# EAGLE design pressure (EAGLE 7.4.0)
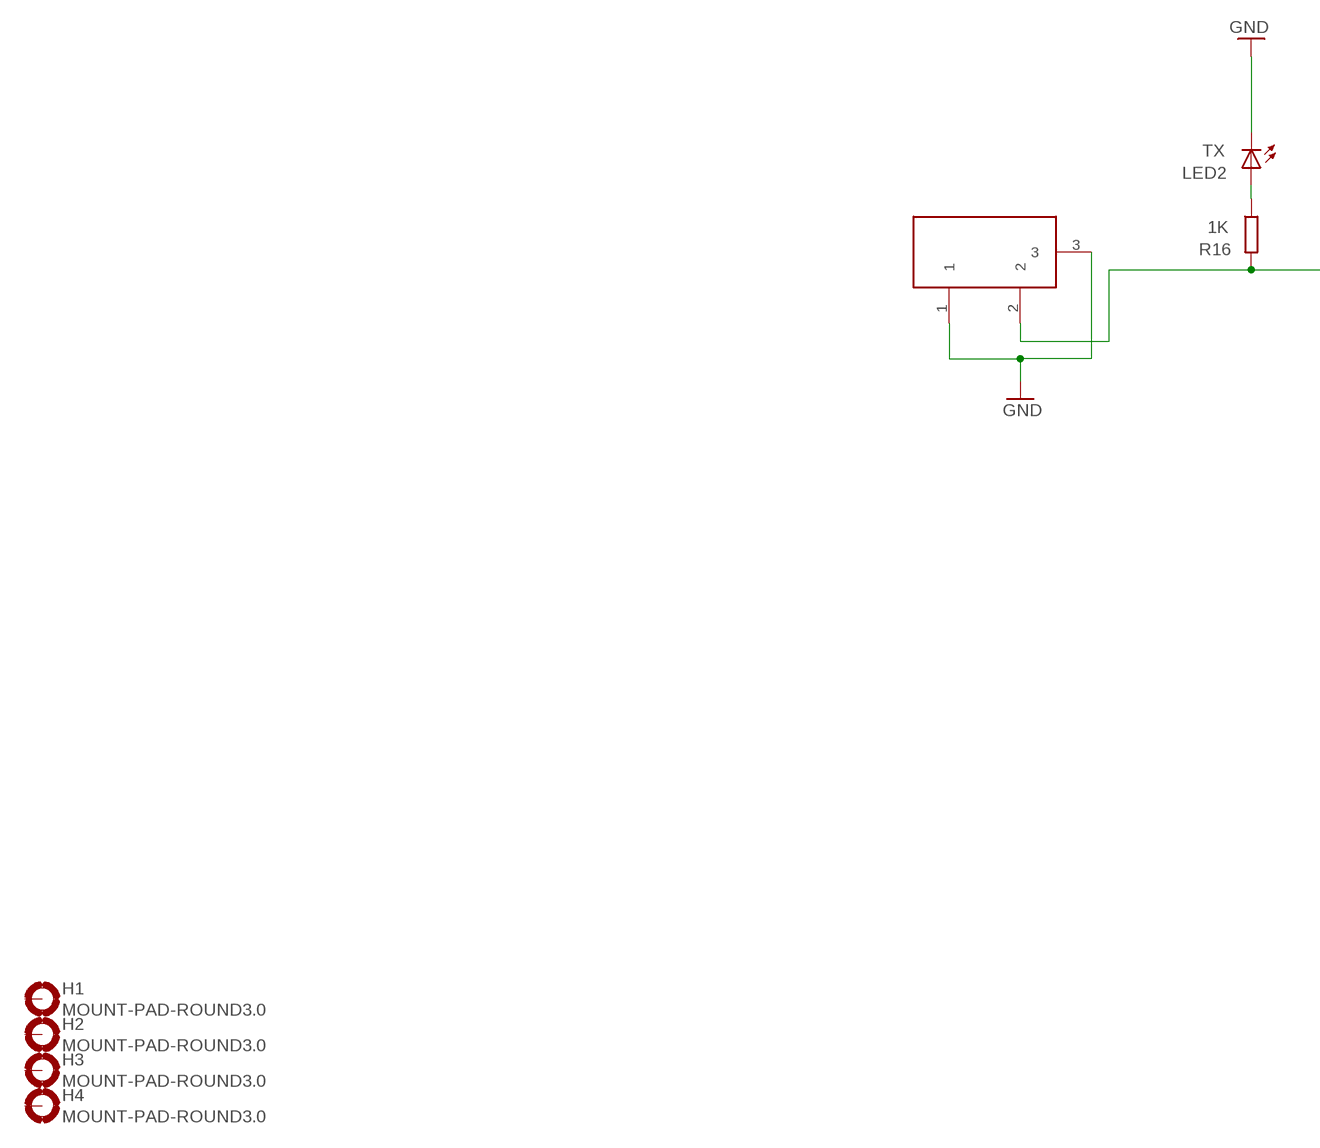
[diagram p0: schematic, sheet 1, part 1 of 2]
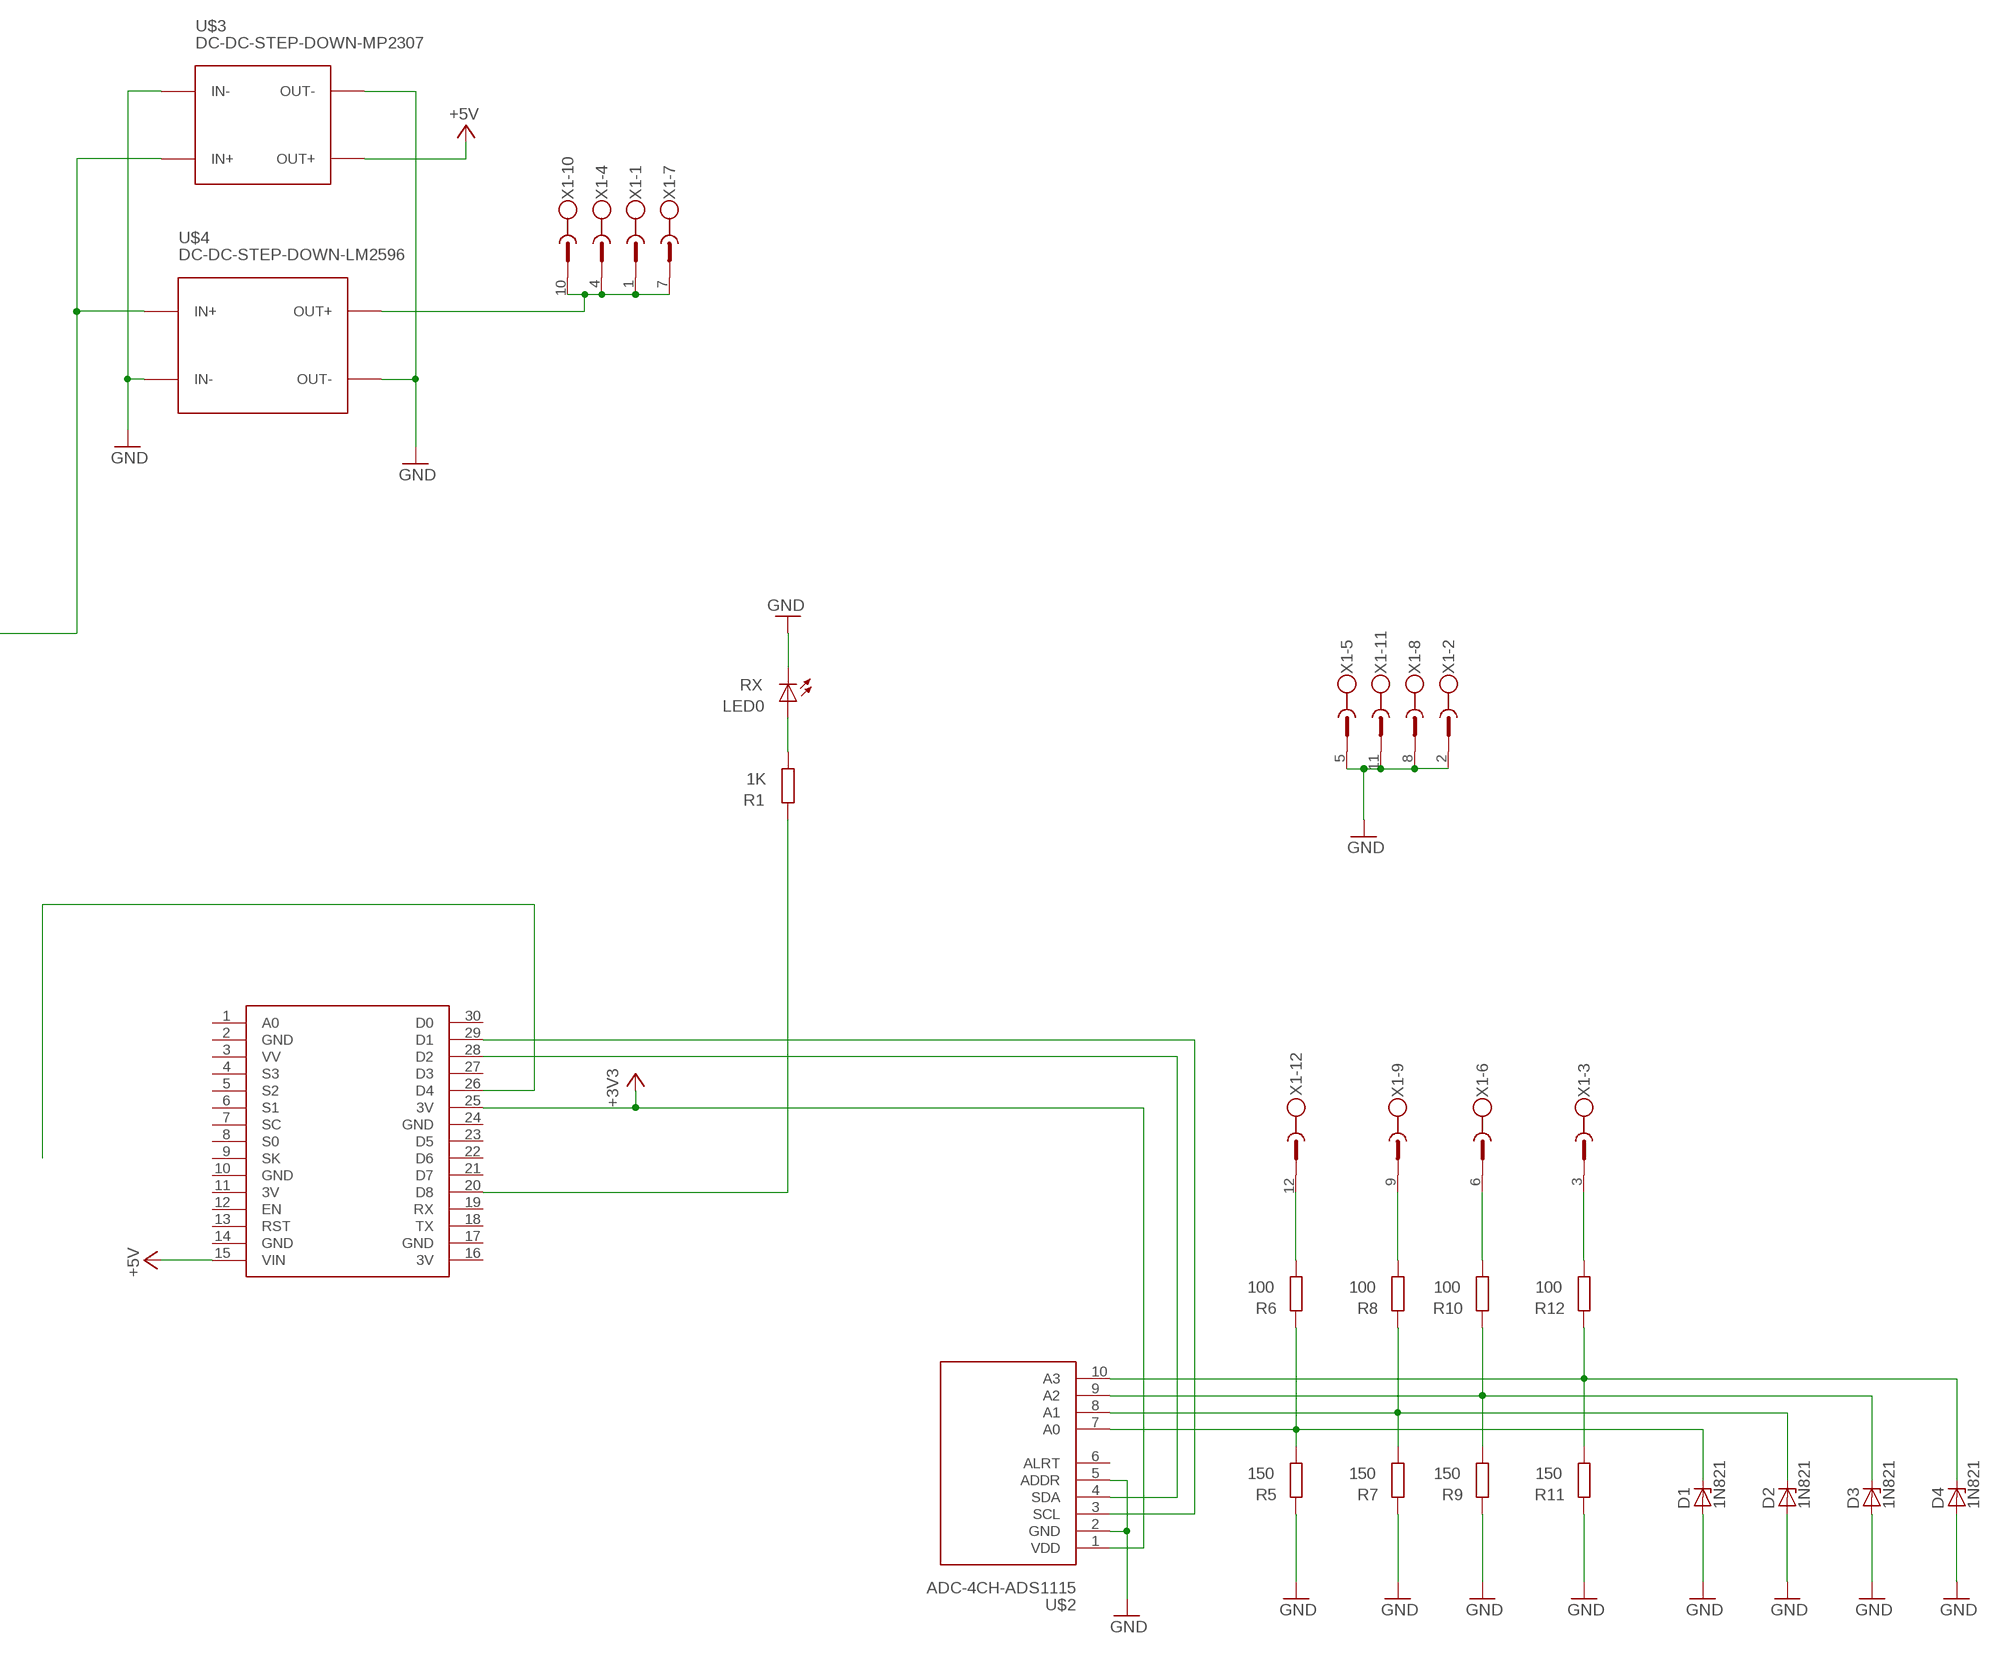
[diagram p1: schematic, sheet 1, part 2 of 2]

## Parts
D1  1N821  [DO35Z10]
D2  1N821  [DO35Z10]
D3  1N821  [DO35Z10]
D4  1N821  [DO35Z10]
DC1  DC21MMX  [DC-21MM]
H1  MOUNT-PAD-ROUND3.0  [3,0-PAD]
H2  MOUNT-PAD-ROUND3.0  [3,0-PAD]
H3  MOUNT-PAD-ROUND3.0  [3,0-PAD]
H4  MOUNT-PAD-ROUND3.0  [3,0-PAD]
LED0  RX  LED5MM  [LED5MM]
LED2  TX  LED5MM  [LED5MM]
R1  1K  R-EU_0207/10  [0207/10]
R5  150  R-EU_0207/10  [0207/10]
R6  100  R-EU_0207/10  [0207/10]
R7  150  R-EU_0207/10  [0207/10]
R8  100  R-EU_0207/10  [0207/10]
R9  150  R-EU_0207/10  [0207/10]
R10  100  R-EU_0207/10  [0207/10]
R11  150  R-EU_0207/10  [0207/10]
R12  100  R-EU_0207/10  [0207/10]
R16  1K  R-EU_0207/10  [0207/10]
U$1  NODEMCU  [NODEMCU]
U$2  ADC-4CH-ADS1115  [ADC-4CH-ADS1115]
U$3  DC-DC-STEP-DOWN-MP2307  [DC-DC-STEP-DOWN-MP2307]
U$4  DC-DC-STEP-DOWN-LM2596  [DC-DC-STEP-DOWN-LM2596]
X1  MSTBV12  [MSTBV12]

## Nets
+3V3: U$1.25(3V) U$2.1(VDD)
+5V [power]: U$1.15(VIN) U$3.OUT+
GND: D1.A D2.A D3.A D4.A DC1.1 DC1.3 LED0.K(C) LED2.K(C) R5.2 R7.2 R9.2 R11.2 U$2.2(GND) U$2.5(ADDR) U$3.IN- U$3.OUT- U$4.IN- U$4.OUT- X1.2 X1.5 X1.8 X1.11
N$2 [power]: DC1.2 R16.2 U$3.IN+ U$4.IN+
N$3: U$4.OUT+ X1.1 X1.4 X1.7 X1.10
N$5: D1.C R5.1 R6.2 U$2.7(A0)
N$6: D2.C R7.1 R8.2 U$2.8(A1)
N$7: D3.C R9.1 R10.2 U$2.9(A2)
N$10: R1.2 U$1.20(D8)
N$14: U$1.26(D4)
N$15: D4.C R11.1 R12.2 U$2.10(A3)
N$16: R6.1 X1.12
N$17: R8.1 X1.9
N$18: R10.1 X1.6
N$19: LED2.A R16.1
N$20: R12.1 X1.3
N$22: U$1.29(D1) U$2.3(SCL)
N$23: U$1.28(D2) U$2.4(SDA)
N$33: LED0.A R1.1
Unconnected: H1.B3,0(MOUNT) H2.B3,0(MOUNT) H3.B3,0(MOUNT) H4.B3,0(MOUNT) U$1.1(A0) U$1.3(VV) U$1.4(S3) U$1.5(S2) U$1.6(S1) U$1.7(SC) U$1.8(S0) U$1.9(SK) U$1.12(EN) U$1.13(RST) U$1.18(TX) U$1.19(RX) U$1.21(D7) U$1.22(D6) U$1.23(D5) U$1.27(D3) U$1.30(D0) U$2.6(ALRT)

## Power pins joined to a net without a drawn wire
3V: U$1.11(3V) U$1.16(3V)
GND: U$1.2(GND) U$1.10(GND) U$1.14(GND) U$1.17(GND) U$1.24(GND)

## Library data of the parts
D1-D4 = diode:1N821: Reference DIODE temperature compensated, 6,2 V
DC1 = powersupply:DC21MM
H1-H4 = holes:MOUNT-PAD-ROUND: MOUNTING PAD, round
LED0 LED2 = led:LED: LED OSRAM: - CHIPLED LG R971, LG N971, LY N971, LG Q971, LY Q971, LO R971, LY R971 LH N974, LH R974 LS Q976, LO Q976, LY Q976 LO Q996 - Hyper CHIPLED LW Q18S LB Q993, LB Q99A, LB R99A - SideLED LS A670, LO A670, LY A670, LG A670, LP A670 LB A673, LV A673, LT A673, LW A673 LH A674 LY A675 LS A676, LA A676, LO A676, LY A676, LW A676 LS A679, LY A679, LG A679 - Hyper Micro SIDELED® LS Y876, LA Y876, LO Y876, LY Y876 LT Y87S - SmartLED LW L88C, LW L88S LB L89C, LB L89S, LG L890 LS L89K, LO L89K, LY L89K LS L896, LA L896, LO L896, LY L896 - TOPLED LS T670, LO T670, LY T670, LG T670, LP T670 LSG T670, LSP T670, LSY T670, LOP T670, LYG T670 LG T671, LOG T671, LSG T671 LB T673, LV T673, LT T673, LW T673 LH T674 LS T676, LA T676, LO T676, LY T676, LB T676, LH T676, LSB T676, LW T676 LB T67C, LV T67C, LT T67C, LS T67K, LO T67K, LY T67K, LW E67C LS E67B, LA E67B, LO E67B, LY E67B, LB E67C, LV E67C, LT E67C LW T67C LS T679, LY T679, LG T679 LS T770, LO T770, LY T770, LG T770, LP T770 LB T773, LV T773, LT T773, LW T773 LH T774 LS E675, LA E675, LY E675, LS T675 LS T776, LA T776, LO T776, LY T776, LB T776 LHGB T686 LT T68C, LB T68C - Hyper Mini TOPLED® LB M676 - Mini TOPLED Santana® LG M470 LS M47K, LO M47K, LY M47K Source: http://www.osram.convergy.de LUXEON: - LUMILED® LXK2-PW12-R00, LXK2-PW12-S00, LXK2-PW14-U00, LXK2-PW14-V00 LXK2-PM12-R00, LXK2-PM12-S00, LXK2-PM14-U00 LXK2-PE12-Q00, LXK2-PE12-R00, LXK2-PE12-S00, LXK2-PE14-T00, LXK2-PE14-U00 LXK2-PB12-K00, LXK2-PB12-L00, LXK2-PB12-M00, LXK2-PB14-N00, LXK2-PB14-P00, LXK2-PB14-Q00 LXK2-PR12-L00, LXK2-PR12-M00, LXK2-PR14-Q00, LXK2-PR14-R00 LXK2-PD12-Q00, LXK2-PD12-R00, LXK2-PD12-S00 LXK2-PH12-R00, LXK2-PH12-S00 LXK2-PL12-P00, LXK2-PL12-Q00, LXK2-PL12-R00 Source: www.luxeon.com KINGBRIGHT: KA-3528ASYC Source: www.kingbright.com
R1 R5-R12 R16 = rcl:R-EU_: RESISTOR, European symbol
U$1 = nodemcu:NODEMCU
U$2 = diy-modules:ADC-4CH-ADS1115: 4 Channel 16-Bit Analog-to-Digital Converter based on ADS1115 chip Arduino ADS1115 Getting Started Tutorial is available here: http://henrysbench.capnfatz.com/henrys-bench/arduino-voltage-measurements/arduino-ads1115-module-getting-started-tutorial/ ADS1115 datasheet is available here: http://www.ti.com/lit/ds/symlink/ads1115.pdf Click here to find device on ebay.com <http://www.ebay.com/sch/ads1115+module>
U$3 = diy-modules:DC-DC-STEP-DOWN-MP2307: DC/DC Step-Down Regulator based on MP2307DN chip MP2307 datasheet available here: https://cdn-shop.adafruit.com/datasheets/MP2307_r1.9.pdf Click here to find device on ebay.com <http://www.ebay.com/sch/dc+dc+3a+mini+converter>
U$4 = diy-modules:DC-DC-STEP-DOWN-LM2596: DC/DC Step-Down Regulator based on LM2596-ADJ chip LM2596 datasheet available here: http://www.ti.com/lit/ds/symlink/lm2596.pdf Click here to find device on ebay.com <http://www.ebay.com/sch/lm2596+power+regulator>
X1 = con-phoenix-custom:MSTBV12: PHOENIX; OC_FARNELL: unknown; OC_NEWARK: unknown

## Net classes
1 power: width 0.61 mm

## Board
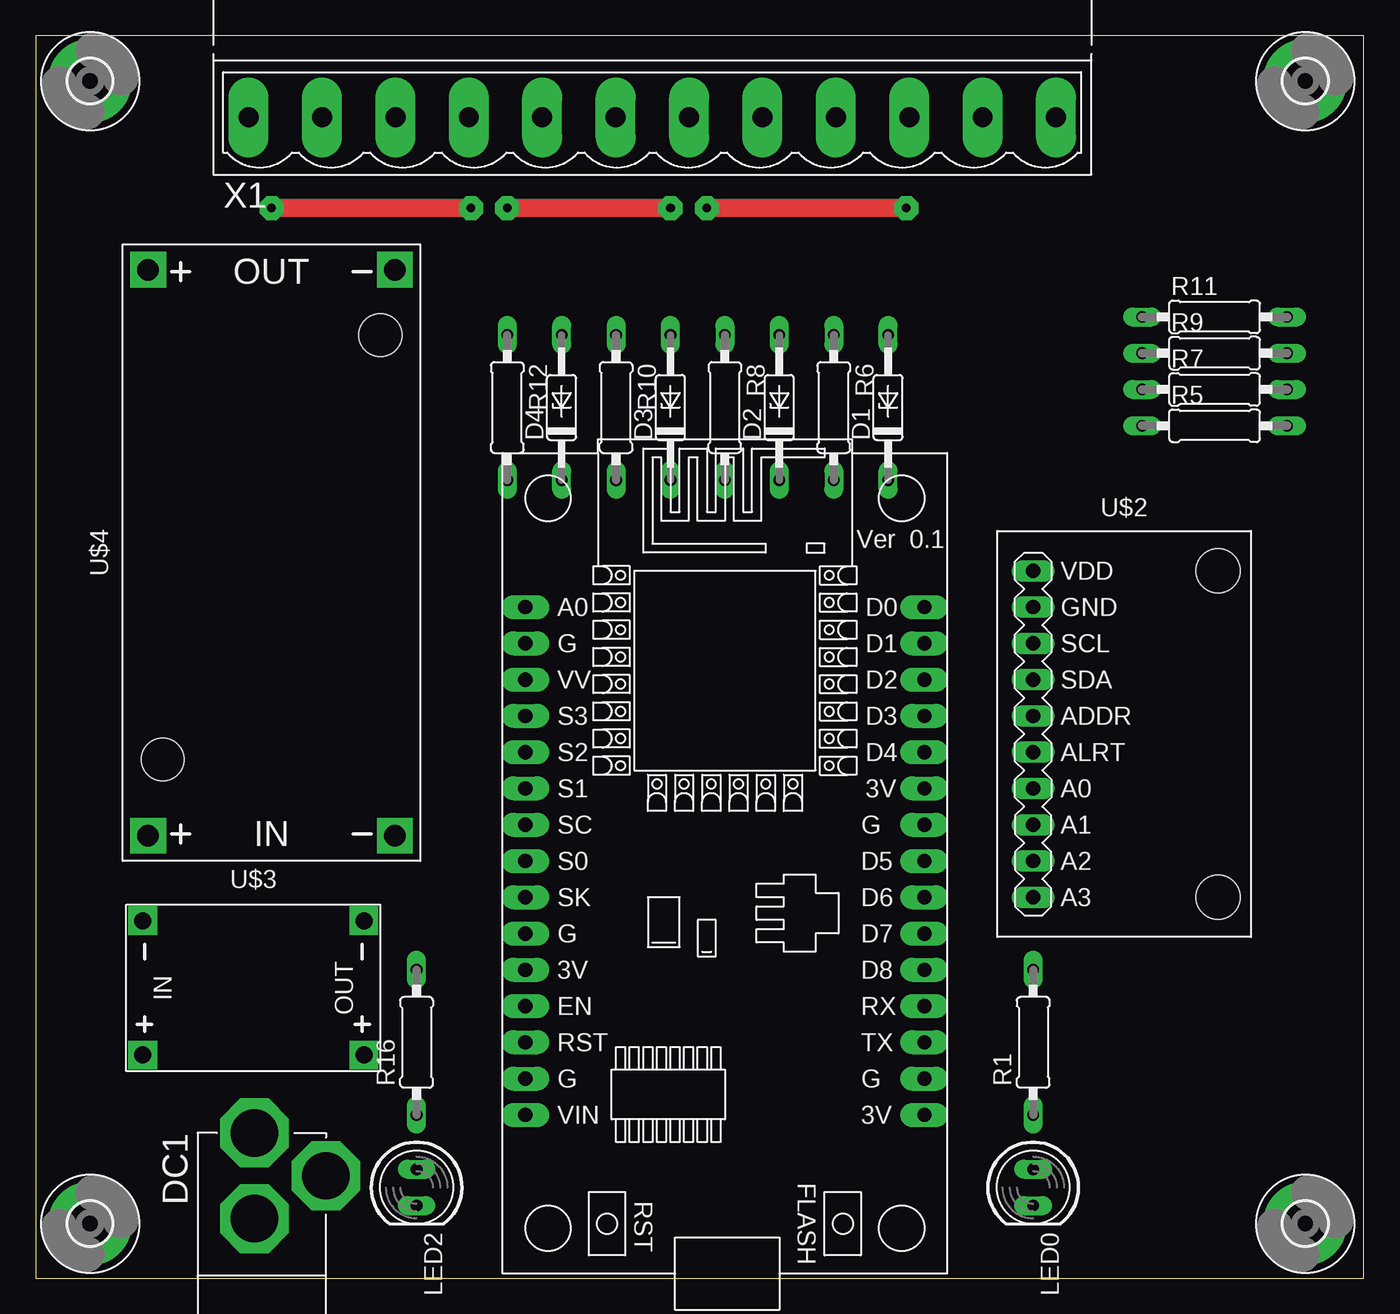
[diagram p2: board, top side]
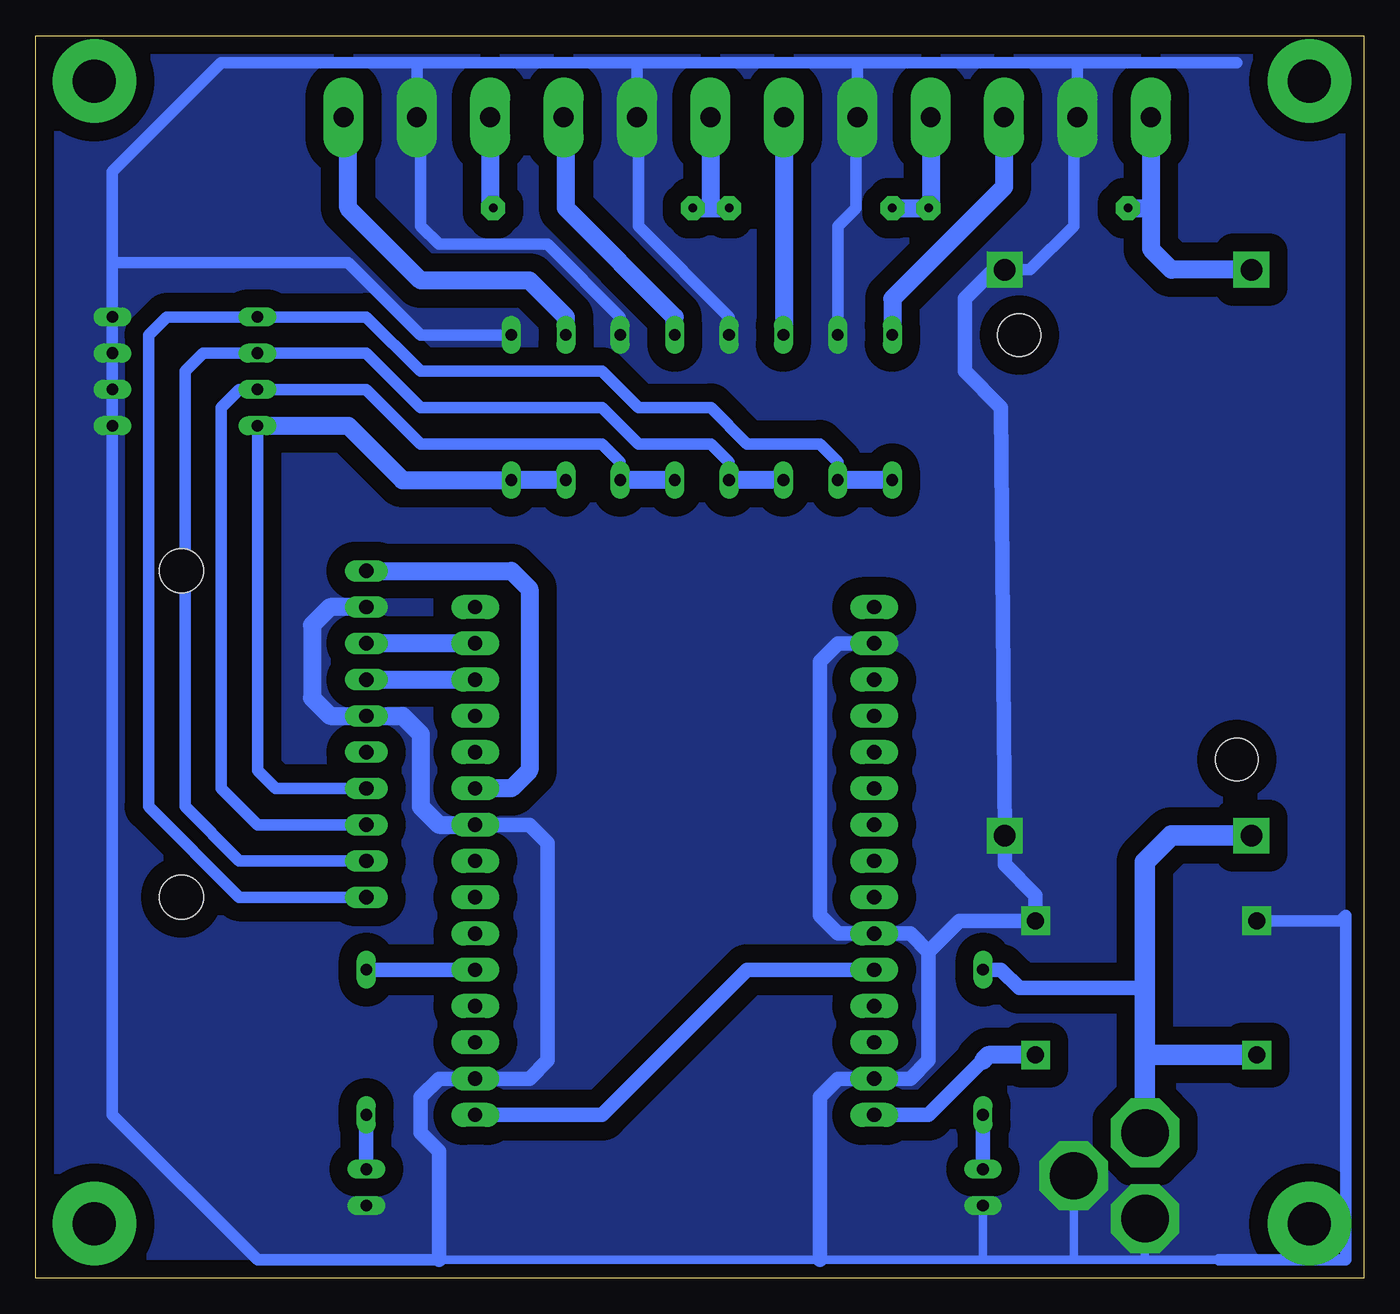
[diagram p3: board, bottom side, seen from below]

Size 93 x 87 mm. Coordinates in mm from the lower left corner, seen from the top.
Outline: 0,0 93,0 93,87 0,87 0,0
Copper layers (1*16): Top 0.035mm / dielectric 1.5mm / Bottom 0.035mm
Design rules "default": minimum track width 10mil, minimum drill 24mil, track to track 8mil, track to pad 8mil, pad to pad 8mil, via to via 8mil, smd to smd 8mil, copper to edge 40mil, drill to drill 8mil, minimum pad ring 10mil, minimum via ring 8mil, stop-mask expansion 4mil, vias tented up to drill 0mil, thermal gap 10mil

### Footprints (pad centres in the part's own frame; a part is rotated, then mirrored left to right if it is on the bottom)
DO35Z10 = drill 0.813 long: A 5.08,0; C -5.08,0
DC-21MM = drill 3.302 pad 4.826 octagon: 1 -5.08,-3.353; 2 -0.076,-6.35; 3 -0.076,-0.356
3,0-PAD = drill 3 pad 5.842: B3,0 0,0
LED5MM = drill 0.813 long: A -1.27,0; K 1.27,0
0207/10 = drill 0.813 long: 1 -5.08,0; 2 5.08,0
NODEMCU = drill 1 pad 1.676 long: 1 -13.97,17.78; 2 -13.97,15.24; 3 -13.97,12.7; 4 -13.97,10.16; 5 -13.97,7.62; 6 -13.97,5.08; 7 -13.97,2.54; 8 -13.97,0; 9 -13.97,-2.54; 10 -13.97,-5.08; 11 -13.97,-7.62; 12 -13.97,-10.16; 13 -13.97,-12.7; 14 -13.97,-15.24; 15 -13.97,-17.78; 16 13.97,-17.78; 17 13.97,-15.24; 18 13.97,-12.7; 19 13.97,-10.16; 20 13.97,-7.62; 21 13.97,-5.08; 22 13.97,-2.54; 23 13.97,0; 24 13.97,2.54; 25 13.97,5.08; 26 13.97,7.62; 27 13.97,10.16; 28 13.97,12.7; 29 13.97,15.24; 30 13.97,17.78
ADC-4CH-ADS1115 = drill 1 long: 1 -6.35,11.43; 2 -6.35,8.89; 3 -6.35,6.35; 4 -6.35,3.81; 5 -6.35,1.27; 6 -6.35,-1.27; 7 -6.35,-3.81; 8 -6.35,-6.35; 9 -6.35,-8.89; 10 -6.35,-11.43 | hole 3.1: 6.604,11.43; 6.604,-11.43
DC-DC-STEP-DOWN-MP2307 = drill 1.2 pad 2 square: IN+ -7.747,-4.699; IN- -7.747,4.699; OUT+ 7.747,-4.699; OUT- 7.747,4.699
DC-DC-STEP-DOWN-LM2596 = drill 1.5 pad 2.5 square: IN+ -19.812,8.636; IN- -19.812,-8.636; OUT+ 19.812,8.636; OUT- 19.812,-8.636 | hole 3: -14.478,7.62; 15.24,-7.62
MSTBV12 = drill 1.397 pad 2.8 long: 1 -28.27,0; 2 -23.13,0; 3 -17.99,0; 4 -12.85,0; 5 -7.71,0; 6 -2.57,0; 7 2.57,0; 8 7.71,0; 9 12.85,0; 10 17.99,0; 11 23.13,0; 12 28.27,0

### Placement (x,y rotation side)
D1  59.69,60.96 90 top
D2  52.07,60.96 90 top
D3  44.45,60.96 90 top
D4  36.83,60.96 90 top
DC1  15.24,3.81 180 top
H1  88.9,3.81 0 top
H2  88.9,83.82 0 top
H3  3.81,83.82 0 top
H4  3.81,3.81 0 top
LED0  69.85,6.35 270 top
LED2  26.67,6.35 270 top
R1  69.85,16.51 90 top
R5  82.55,59.69 0 top
R6  55.88,60.96 270 top
R7  82.55,62.23 0 top
R8  48.26,60.96 270 top
R9  82.55,64.77 0 top
R10  40.64,60.96 270 top
R11  82.55,67.31 0 top
R12  33.02,60.96 270 top
R16  26.67,16.51 90 top
U$1  48.26,29.21 0 top
U$2  76.2,38.1 0 top
U$3  15.24,20.32 0 top
U$4  16.51,50.8 90 top
X1  43.18,81.28 0 top

### Tracks (layer width: path | path; a pad name or v marks a point on that pad's centre or on a via)
3V
  Bottom 1.016: U$1.11 43.18,21.59 53.34,11.43 U$1.16
+3V3
  Bottom 1.27: U$2.1 59.69,49.53 58.42,48.26 58.42,35.56 59.69,34.29 U$1.25
+5V
  Bottom 1.016: U$1.15 30.48,11.43 26.67,15.24
  Bottom 1.27: U$3.OUT+ 26.29,15.62 26.67,15.24
GND
  Bottom 0.61: 64.77,1.27 38.1,1.27 26.67,1.27 | 26.67,1.27 20.32,1.27 | 20.32,1.27 15.24,1.27 | 15.24,1.27 10.16,1.27 | DC1.3 15.32,1.35 15.24,1.27 | DC1.1 20.32,1.27 | LED2.K 26.67,1.27
  Bottom 0.813: 64.77,1.27 77.47,1.27 87.63,11.43 R5.2 R7.2 R9.2 R11.2 87.63,71.12 | 87.63,71.12 87.63,77.47 80.01,85.09 66.04,85.09 | U$3.IN- 1.65,25.02 1.27,25.4 1.27,1.27 10.16,1.27 | 20.32,85.09 35.56,85.09 | 35.56,85.09 50.8,85.09 | 50.8,85.09 66.04,85.09 | 66.04,85.09 66.31,84.82 X1.11 66.04,79.74 66.04,73.66 64.77,72.39 57.15,72.39 52.07,67.31 D2.A | 50.8,85.09 50.89,85 X1.8 50.8,79.92 50.8,73.66 44.45,67.31 D3.A | 35.56,85.09 35.47,85 X1.5 35.56,79.92 35.56,74.93 36.83,73.66 D4.A | U$4.OUT- 23.37,70.61 20.32,73.66 20.32,80.01 | D1.A 66.04,66.04 71.12,71.12 87.63,71.12 | X1.2 20.05,84.82 20.32,85.09 | 8.89,85.09 20.32,85.09
  Bottom 1.016: 64.77,1.27 64.77,8.89 66.04,10.16 66.04,12.7 64.77,13.97 U$1.17 58.42,13.97 57.15,15.24 57.15,30.48 58.42,31.75 U$1.24 | U$1.2 36.83,44.45 38.1,43.18 38.1,25.4 36.83,24.13 U$1.10 31.75,24.13 30.48,22.86 | 30.48,22.86 30.48,15.24 31.75,13.97 U$1.14 36.83,13.97 38.1,12.7 38.1,1.27 | U$4.OUT- 25.91,70.61 27.94,68.58 27.94,63.5 25.4,60.96 U$4.IN- 25.15,28.96 22.99,26.8 U$3.OUT- 28.32,25.02 30.48,22.86
  Bottom 1.27: U$2.2 72.39,46.99 73.66,45.72 73.66,40.64 72.39,39.37 U$2.5 67.31,39.37 66.04,38.1 66.04,33.02 64.77,31.75 U$1.24
  pour Bottom (isolate 1.27, no thermals): -1.27,-1.27 -2.54,92.71 93.98,87.63 93.98,-1.27
N$2
  Bottom 1.016: R16.2 25.4,21.59 24.13,20.32 15.32,20.32
  Bottom 1.422: DC1.2 15.32,15.24 | 15.32,15.24 15.32,20.32 15.32,29.13 13.46,30.99 U$4.IN+ | U$3.IN+ 14.94,15.62 15.32,15.24
N$3  (via drill 0.6 pad 1.68)
  Top 1.27: v60.96,74.93 v46.99,74.93 | v44.45,74.93 v33.02,74.93 | v30.48,74.93 v16.51,74.93
  Bottom 1.27: X1.1 14.91,74.93 | X1.10 61.17,75.14 v60.96,74.93 | v46.99,74.93 45.72,74.93 | 45.72,74.93 v44.45,74.93 | v33.02,74.93 v30.48,74.93 30.33,75.08 X1.4 | v16.51,74.93 14.91,74.93 | X1.7 45.75,74.96 45.72,74.93 | U$4.OUT+ 13.46,70.61 14.91,72.06 14.91,74.93
N$5
  Bottom 0.813: U$2.7 76.2,34.29 77.47,35.56 R5.1
  Bottom 1.27: R5.1 71.12,59.69 67.31,55.88 D1.C R6.2
N$6
  Bottom 0.813: U$2.8 77.47,31.75 80.01,34.29 80.01,60.96 78.74,62.23 R7.1 69.85,62.23 66.04,58.42 53.34,58.42 52.07,57.15 D2.C
  Bottom 1.27: R8.2 D2.C
N$7
  Bottom 0.813: U$2.9 78.74,29.21 82.55,33.02 82.55,63.5 81.28,64.77 R9.1 69.85,64.77 66.04,60.96 53.34,60.96 50.8,58.42 45.72,58.42 44.45,57.15 D3.C
  Bottom 1.27: R10.2 D3.C
N$10
  Bottom 1.016: U$1.20 R1.2
N$15
  Bottom 0.813: U$2.10 78.74,26.67 85.09,33.02 85.09,66.04 83.82,67.31 R11.1 69.85,67.31 66.04,63.5 53.34,63.5 50.8,60.96 45.72,60.96 43.18,58.42 38.1,58.42 36.83,57.15 D4.C
  Bottom 1.27: R12.2 D4.C
N$16
  Bottom 1.27: R6.1 55.88,67.31 58.42,69.85 66.04,69.85 71.12,74.93 71.12,79.68 X1.12
N$17
  Bottom 1.27: R8.1 48.26,67.31 55.88,74.93 55.88,80.16 | 55.88,81.28 55.88,80.16 | 55.88,80.16 X1.9
N$18
  Bottom 1.27: X1.6 40.61,66.07 R10.1
N$19
  Bottom 1.016: R16.1 LED2.A
N$20
  Bottom 1.27: X1.3 25.19,76.41 33.02,68.58 R12.1
N$22
  Bottom 1.27: U$1.29 U$2.3
N$23
  Bottom 1.27: U$2.4 U$1.28
N$33
  Bottom 1.016: LED0.A R1.1